# Altium project GateWayLoRa.PrjPcb
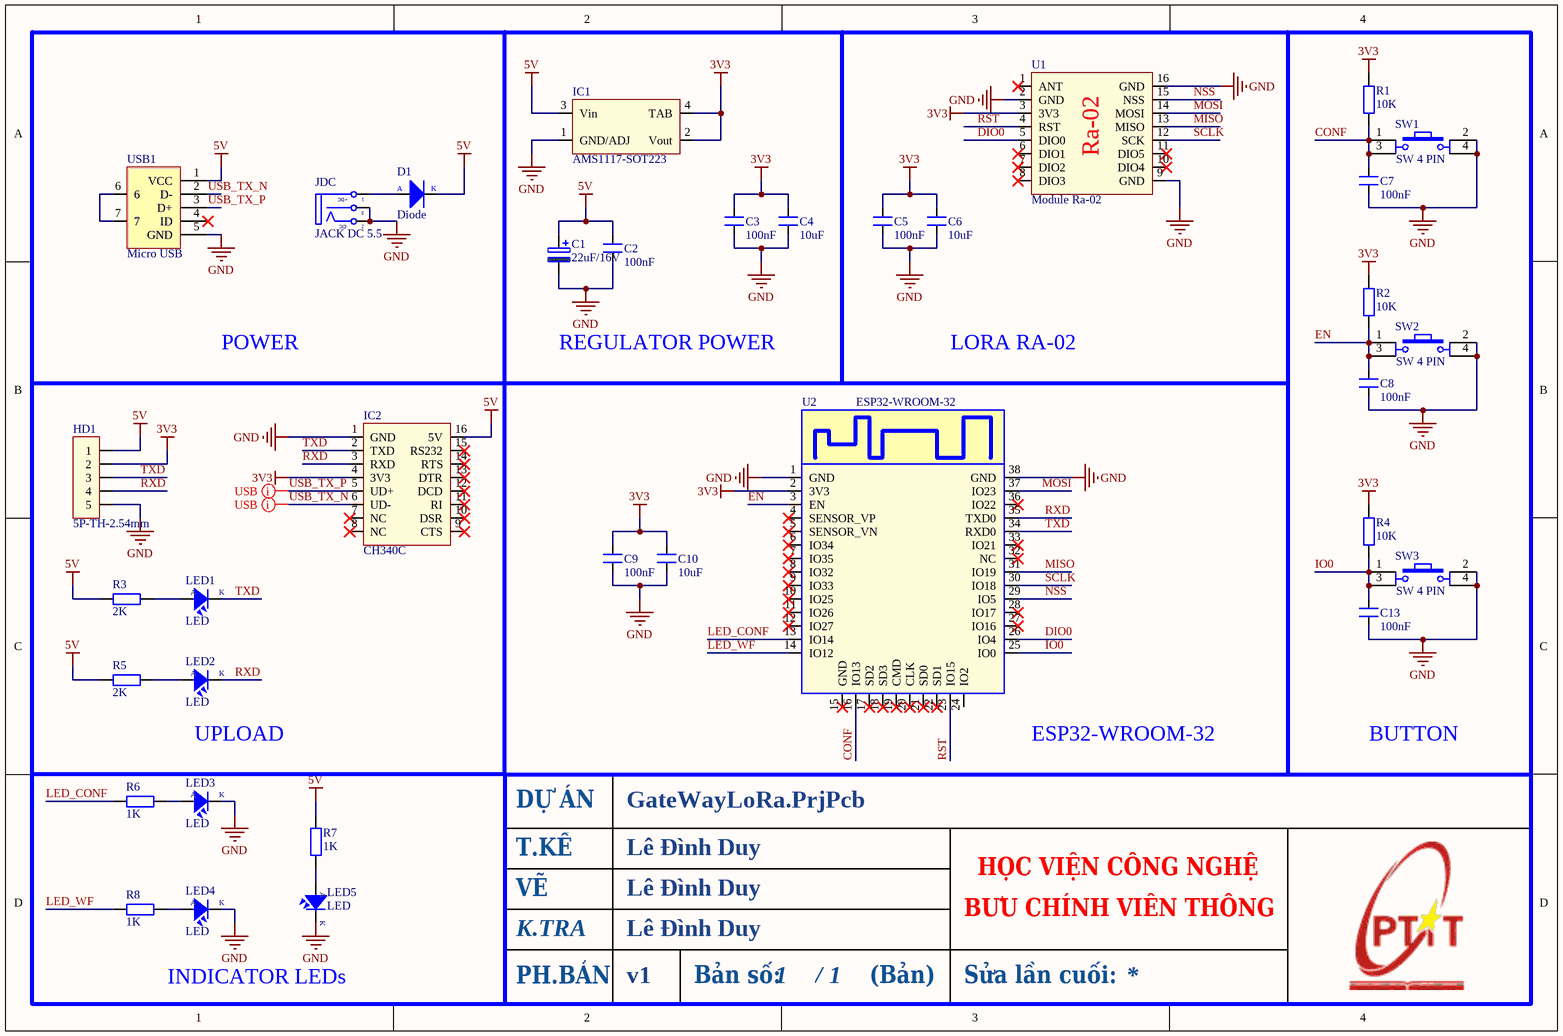
[diagram p0: SDNL_DATN_RX_v1.SchDoc]
1 sheet, 35 parts. Net scope: global (net labels, ports and power ports of the same name join across sheets).
Board file: PCB_DATN_RX_v1.PcbDoc

## Sheet SDNL_DATN_RX_v1.SchDoc
size A4; ApprovedBy: Lê Đình Duy; CheckedBy: Lê Đình Duy; Author: Lê Đình Duy; DrawnBy: Lê Đình Duy; Revision: v1; SheetNumber: 1; SheetTotal: 1

### Parts
C1  22uF/16V  [Cap Aluminum 4x5.4]
C2  100nF  [CAP SMD 0805]
C3  100nF  [CAP SMD 0805]
C4  10uF  [CAP SMD 0805]
C5  100nF  [CAP SMD 0805]
C6  10uF  [CAP SMD 0805]
C7  100nF  [CAP SMD 0805]
C8  100nF  [CAP SMD 0805]
C9  100nF  [CAP SMD 0805]
C10  10uF  [CAP SMD 0805]
C13  100nF  [CAP SMD 0805]
D1  Diode  [DIODE SMA]
HD1  5P-TH-2.54mm  [XH2.54-5P]
IC1  AMS1117-SOT223  [AMS1117-SOT223]
IC2  CH340C  [SOP-16]
JDC  JACK DC 5.5  [DC IN]
LED1  LED  [LED SMD 0805]
LED2  LED  [LED SMD 0805]
LED3  LED  [LED SMD 0805]
LED4  LED  [LED SMD 0805]
LED5  LED  [LED SMD 0805]
R1  10K  [RES SMD 0805]
R2  10K  [RES SMD 0805]
R3  2K  [RES SMD 0805]
R4  10K  [RES SMD 0805]
R5  2K  [RES SMD 0805]
R6  1K  [RES SMD 0805]
R7  1K  [RES SMD 0805]
R8  1K  [RES SMD 0805]
SW1  SW 4 PIN  [SW 4 PIN TH]
SW2  SW 4 PIN  [SW 4 PIN TH]
SW3  SW 4 PIN  [SW 4 PIN TH]
U1  Module Ra-02  [module ra02]
U2  ESP32-WROOM-32  [ESP32-WROOM-32]
USB1  Micro USB  [MICRO USB CONNECTOR]

### Nets
3V3: C3.2 C4.2 C5.2 C6.2 C9.2 C10.2 HD1.2 IC1.2(Vout) IC1.4(TAB) IC2.4(3V3) R1.2 R2.2 R4.2 U1.3(3V3) U2.2(3V3)
5V: C1.1 C2.2 D1.2(K) HD1.1 IC1.3(Vin) IC2.16(5V) R3.2 R5.2 R7.1 USB1.1(VCC)
GND: C1.2 C2.1 C3.1 C4.1 C5.1 C6.1 C7.1 C8.1 C9.1 C10.1 C13.1 HD1.5 IC1.1(GND/ADJ) IC2.1(GND) JDC.2(TN) JDC.3(S) LED3.2(K) LED4.2(K) LED5.2(K) SW1.2 SW1.4 SW2.2 SW2.4 SW3.2 SW3.4 U1.2(GND) U1.9(GND) U1.16(GND) U2.1(GND) U2.38(GND) USB1.5(GND)
CONF: C7.2 R1.1 SW1.1 SW1.3 U2.16(IO13)
DIO0: U1.5(DIO0) U2.26(IO4)
EN: C8.2 R2.1 SW2.1 SW2.3 U2.3(EN)
IO0: C13.2 R4.1 SW3.1 SW3.3 U2.25(IO0)
LED_CONF: R6.1 U2.13(IO14)
LED_WF: R8.1 U2.14(IO12)
MISO: U1.13(MISO) U2.31(IO19)
MOSI: U1.14(MOSI) U2.37(IO23)
NSS: U1.15(NSS) U2.29(IO5)
RST: U1.4(RST) U2.23(IO15)
RXD: HD1.4 IC2.3(RXD) LED2.2(K) U2.35(TXD0)
SCLK: U1.12(SCK) U2.30(IO18)
TXD: HD1.3 IC2.2(TXD) LED1.2(K) U2.34(RXD0)
USB_TX_N: IC2.6(UD-) USB1.2(D-)
USB_TX_P: IC2.5(UD+) USB1.3(D+)
NetD1_1: D1.1(A) JDC.1(T)
NetLED1_1: LED1.1(A) R3.1
NetLED2_1: LED2.1(A) R5.1
NetLED3_1: LED3.1(A) R6.2
NetLED4_1: LED4.1(A) R8.2
NetLED5_1: LED5.1(A) R7.2
NetUSB1_6: USB1.6 USB1.7

Not connected (* = marked no-connect by the designer): IC2 7(NC)* 8(NC)* 9(CTS)* 10(DSR)* 11(RI)* 12(DCD)* 13(DTR)* 14(RTS)* 15(RS232)*; U1 1(ANT)* 6(DIO1)* 7(DIO2)* 8(DIO3)* 10(DIO4)* 11(DIO5)*; U2 4(SENSOR_VP)* 5(SENSOR_VN)* 6(IO34)* 7(IO35)* 8(IO32)* 9(IO33)* 10(IO25)* 11(IO26)* 12(IO27)* 15(GND)* 17(SD2)* 18(SD3)* 19(CMD)* 20(CLK)* 21(SD0)* 22(SD1)* 24(IO2) 27(IO16)* 28(IO17)* 32(NC)* 33(IO21)* 36(IO22)*; USB1 4(ID)*

### Layout directives
differential pair: USB_TX_N, USB_TX_P

### Notes on the sheet
- POWER
- REGULATOR POWER
- LORA RA-02
- UPLOAD
- (near U2) ESP32-WROOM-32
- BUTTON
- INDICATOR LEDs
- DỰ ÁN
- T.KẾ
- VẼ
- BƯU CHÍNH VIỄN THÔNG
- HỌC VIỆN CÔNG NGHỆ
- K.TRA
- PH.BẢN
- Bản số:
- /
- (Bản)
- Sửa lần cuối:
- (in symbol DC IN 5.5) +DC; -DC
- (in symbol Module Ra02) Ra-02

### Library data of the parts
C1 = Capacitor Polarity: CAP ALUMINUM
C2 C3 C5 C7-C9 C13 = CM: CM 0805; Value: 103
C4 C6 C10 = CM: Cap SMD; Value: 103
HD1 = Con5
IC1 = AMS1117
JDC = DC IN 5.5
LED1-LED5 = LED: LED Single colour Green and Red; Value: LED 3 ly Single Colour
R1-R5 = RM: Resistor SMD; Value: 1K
R6-R8 = RM: Resistor SMD; Value: 1K
U1 = Module Ra02
USB1 = Micro USB Connector